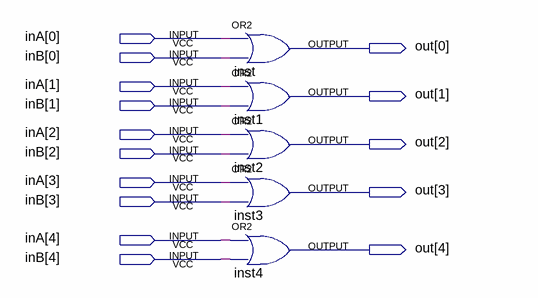
[diagram p0: schematic sheet]
// Quartus schematic merger5Bit.bdf as structural Verilog: 5 symbols, 15 pins
module merger5Bit (
  input  [4:0] inA,
  input  [4:0] inB,
  output [4:0] out
);

  or inst (out[0], inA[0], inB[0]);
  or inst1 (out[1], inA[1], inB[1]);
  or inst2 (out[2], inA[2], inB[2]);
  or inst3 (out[3], inA[3], inB[3]);
  or inst4 (out[4], inA[4], inB[4]);
endmodule
